# Altium schematic sheet Sheet1.SchDoc
size A4; SheetNumber: 1; SheetTotal: 1
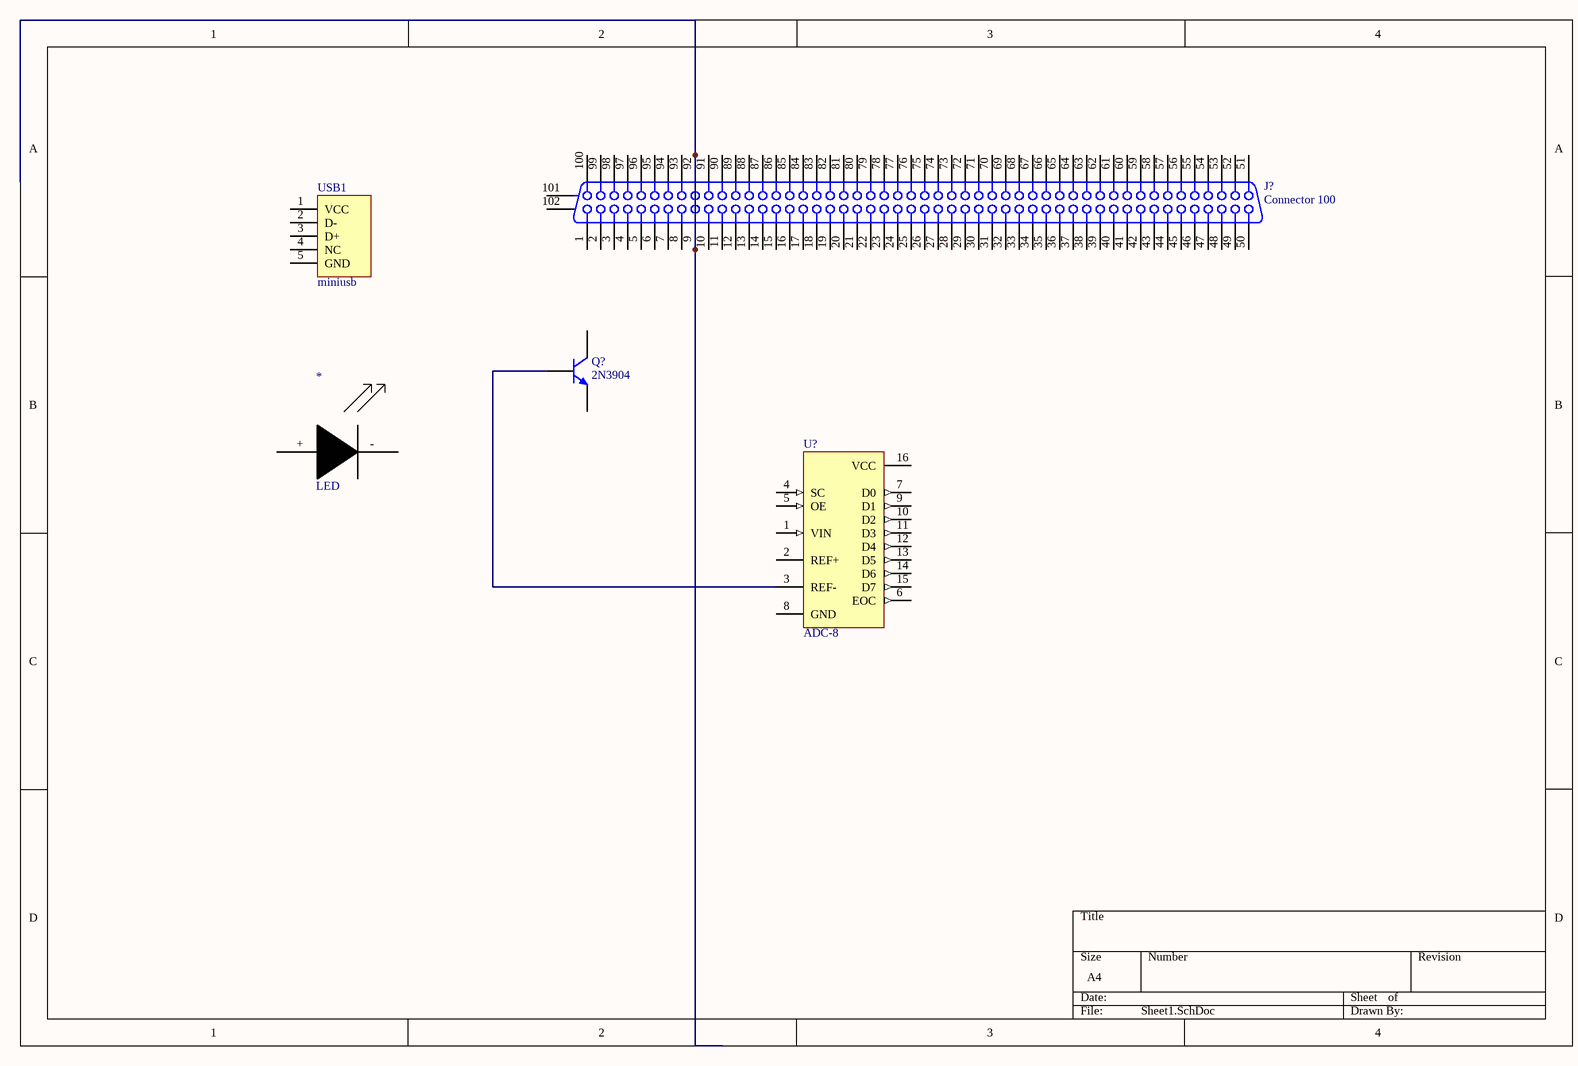
[diagram p0: Sheet1.SchDoc]

## Parts
*  LED
J?  Connector 100  [CHAMP1.27-2H100]
Q?  2N3904  [TO-92A]
U?  ADC-8  [SOT403-1_N]
USB1  miniusb

## Nets
NetJ?_9: J?.9 J?.92
NetQ?_2: Q?.2(B) U?.3(REF-)

Not connected (* = marked no-connect by the designer): * +(6) -; J? 1 2 3 4 5 6 7 8 10 11 12 13 14 15 16 17 18 19 20 21 22 23 24 25 26 27 28 29 30 31 32 33 34 35 36 37 38 39 40 41 42 43 44 45 46 47 48 49 50 51 52 53 54 55 56 57 58 59 60 61 62 63 64 65 66 67 68 69 70 71 72 73 74 75 76 77 78 79 80 81 82 83 84 85 86 87 88 89 90 91 93 94 95 96 97 98 99 100 101(MH1) 102(MH2); Q? 1(E) 3(C); U? 1(VIN) 2(REF+) 4(SC) 5(OE) 6(EOC) 7(D0) 8(GND) 9(D1) 10(D2) 11(D3) 12(D4) 13(D5) 14(D6) 15(D7) 16(VCC); USB1 1(VCC) 2(D-) 3(D+) 4(NC) 5(GND)

## Library data of the parts
J? = Connector 100: Receptacle Header Assemby; PackageDocument: B; Positions: 100; Published: 15-Jun-2001; LatestRevisionDate: 17-Jul-2002; LatestRevisionNote: Re-released for DXP Platform.; DatasheetDocument: 1-Oct-1983; PackageReference: 178240-9; Publisher: Altium Limited; Orientation: Right Angle
Q? = 2N3904: NPN General Purpose Amplifier; Published: 8-Jun-2000; LatestRevisionDate: 15-Jan-2003; LatestRevisionNote: PCB Footprint 'BCY-W3/D4.7' replaced; DatasheetVersion: 1997; PackageVersion: Sep-1998; PackageReference: TO-92A; Publisher: Altium Limited; PackageDescription: TO, Flat Index; 3 In-Line, Axial Leads; Body Dia. 4.5mm; Leads 0.51 x 0.48 mm (max); ComponentLink1Description: Manufacturer Link; ComponentLink1URL: http://www.fairchildsemi.com/; ComponentLink2Description: Datasheet; ComponentLink2URL: http://www.fairchildsemi.com/ds/2N%2F2N3904.pdf
U? = ADC-8: Generic 8-Bit A/D Converter; Published: 8-Jun-2000; LatestRevisionDate: 29-May-2009; LatestRevisionNote: IPC-7351 Footprint Added.; PackageVersion: Mar-2002; PackageReference: SOT403-1; Publisher: Altium Limited; PackageDescription: 16-Pin Thin Small Outline Package 0.65 mm Pitch; Code_JEDEC: MO-153